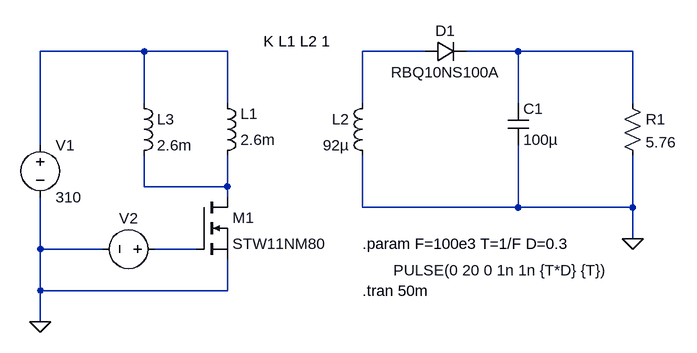
[diagram p0: schematic flyback_100W.asc]
flyback_100W.asc, the LTspice schematic file:
Version 4.1
SHEET 1 1024 680
WIRE 176 48 16 48
WIRE 304 48 176 48
WIRE 608 48 512 48
WIRE 752 48 672 48
WIRE 928 48 752 48
WIRE 176 128 176 48
WIRE 304 128 304 48
WIRE 512 128 512 48
WIRE 752 128 752 48
WIRE 928 128 928 48
WIRE 16 192 16 48
WIRE 176 256 176 208
WIRE 304 256 304 208
WIRE 304 256 176 256
WIRE 304 272 304 256
WIRE 512 288 512 208
WIRE 752 288 752 192
WIRE 752 288 512 288
WIRE 928 288 928 208
WIRE 928 288 752 288
WIRE 928 336 928 288
WIRE 16 352 16 272
WIRE 112 352 16 352
WIRE 256 352 192 352
WIRE 16 416 16 352
WIRE 304 416 304 368
WIRE 304 416 16 416
WIRE 16 464 16 416
FLAG 16 464 0
FLAG 928 336 0
SYMBOL voltage 16 176 R0
WINDOW 123 0 0 Left 0
WINDOW 39 0 0 Left 0
SYMATTR InstName V1
SYMATTR Value 310
SYMBOL ind 288 224 M180
WINDOW 0 36 80 Left 2
WINDOW 3 36 40 Left 2
SYMATTR InstName L1
SYMATTR Value 2.6m
SYMBOL ind 528 112 M0
SYMATTR InstName L2
SYMATTR Value 92µ
SYMBOL nmos 256 272 R0
SYMATTR InstName M1
SYMATTR Value STW11NM80
SYMBOL diode 608 64 R270
WINDOW 0 32 32 VTop 2
WINDOW 3 0 32 VBottom 2
SYMATTR InstName D1
SYMATTR Value RBQ10NS100A
SYMBOL cap 736 128 R0
SYMATTR InstName C1
SYMATTR Value 100µ
SYMBOL res 912 112 R0
SYMATTR InstName R1
SYMATTR Value 5.76
SYMBOL voltage 208 352 R90
WINDOW 0 -32 56 VBottom 2
WINDOW 3 17 -518 VTop 2
WINDOW 123 0 0 Left 0
WINDOW 39 0 0 Left 0
SYMATTR InstName V2
SYMATTR Value PULSE(0 20 0 1n 1n {T*D} {T})
SYMBOL ind 160 112 R0
SYMATTR InstName L3
SYMATTR Value 2.6m
TEXT 512 344 Left 2 !.param F=100e3 T=1/F D=0.3
TEXT 512 416 Left 2 !.tran 50m
TEXT 360 32 Left 2 !K L1 L2 1

The netlist it stands for:
* flyback_100W.asc
V1 N001 0 310
L1 N004 N001 2.6m
L2 N002 0 92µ
M1 N004 N005 0 0 STW11NM80
D1 N002 N003 RBQ10NS100A
C1 N003 0 100µ
R1 N003 0 5.76
V2 N005 0 PULSE(0 20 0 1n 1n {T*D} {T})
L3 N001 N004 2.6m
.model D D
.lib standard.dio
.model NMOS NMOS
.model PMOS PMOS
.lib standard.mos
.param F=100e3 T=1/F D=0.3
.tran 50m
K L1 L2 1
.backanno
.end